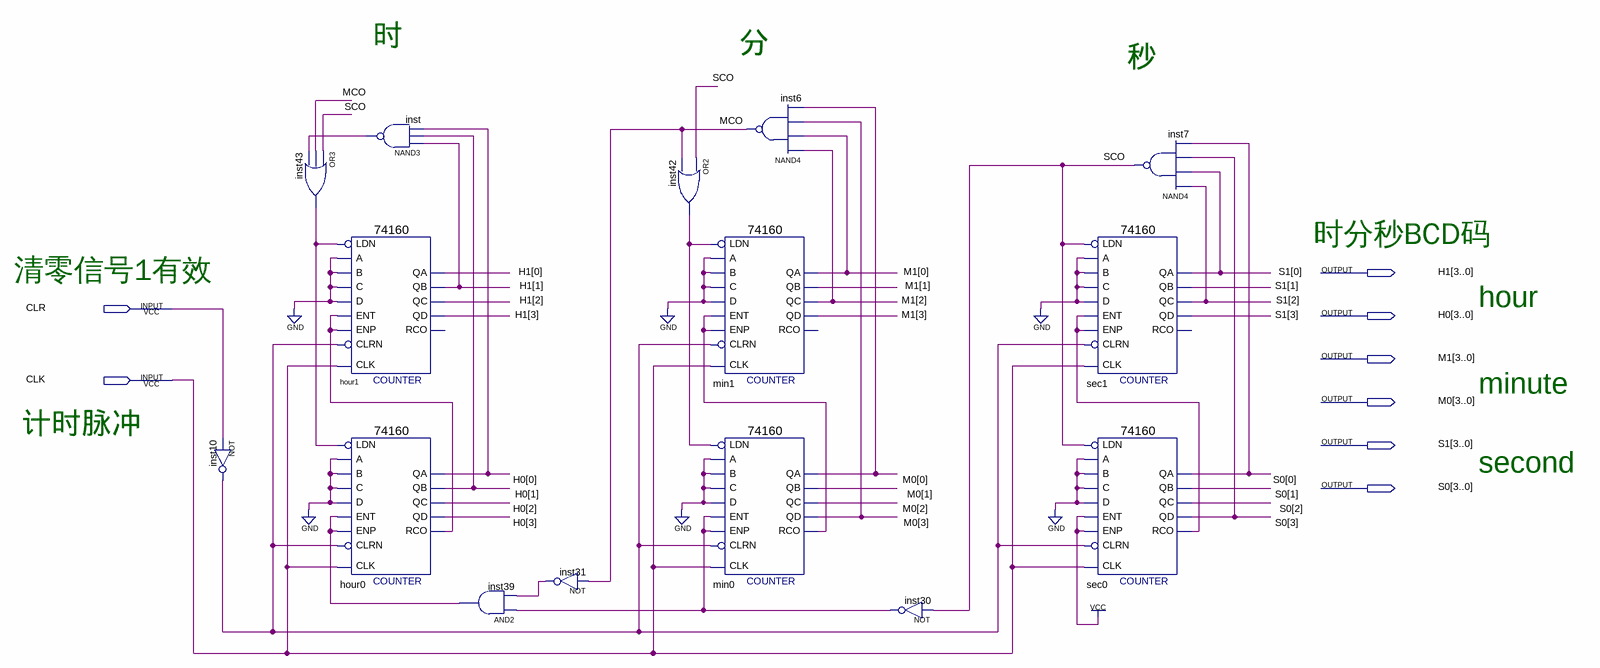
[diagram p0: schematic sheet]
// Quartus schematic clock.bdf as structural Verilog: 15 symbols, 8 pins
module clock (
  input  CLR,
  input  CLK,
  output [3:0] H1,
  output [3:0] H0,
  output [3:0] M1,
  output [3:0] M0,
  output [3:0] S1,
  output [3:0] S0
);

  wire hour0_rco, inst10_out, inst30_out, inst31_out, inst39_out, inst42_out, inst43_out, inst_out, MCO,
       min0_rco, SCO, sec0_rco;

  not inst10 (inst10_out, CLR);
  or inst43 (inst43_out, SCO, MCO, inst_out);
  \74160  hour1 (
    .CLK(CLK), .ENT(hour0_rco), .A(1'b0), .B(1'b0), .C(1'b0), .D(1'b0), .LDN(inst43_out), .ENP(hour0_rco),
    .CLRN(inst10_out), .QD(H1[3]), .QA(H1[0]), .QB(H1[1]), .QC(H1[2]));  // open: RCO
  \74160  hour0 (
    .CLK(CLK), .ENT(inst39_out), .A(1'b0), .B(1'b0), .C(1'b0), .D(1'b0), .LDN(inst43_out), .ENP(inst39_out),
    .CLRN(inst10_out), .QD(H0[3]), .QA(H0[0]), .QB(H0[1]), .QC(H0[2]), .RCO(hour0_rco));
  nand inst (inst_out, H1[1], H0[1], H0[0]);
  and inst39 (inst39_out, inst30_out, inst31_out);
  not inst31 (inst31_out, MCO);
  or inst42 (inst42_out, SCO, MCO);
  \74160  min1 (
    .CLK(CLK), .ENT(min0_rco), .A(1'b0), .B(1'b0), .C(1'b0), .D(1'b0), .LDN(inst42_out), .ENP(min0_rco),
    .CLRN(inst10_out), .QD(M1[3]), .QA(M1[0]), .QB(M1[1]), .QC(M1[2]));  // open: RCO
  \74160  min0 (
    .CLK(CLK), .ENT(inst30_out), .A(1'b0), .B(1'b0), .C(1'b0), .D(1'b0), .LDN(inst42_out), .ENP(inst30_out),
    .CLRN(inst10_out), .QD(M0[3]), .QA(M0[0]), .QB(M0[1]), .QC(M0[2]), .RCO(min0_rco));
  nand inst6 (MCO, M1[2], M1[0], M0[3], M0[0]);
  not inst30 (inst30_out, SCO);
  \74160  sec1 (
    .CLK(CLK), .ENT(sec0_rco), .A(1'b0), .B(1'b0), .C(1'b0), .D(1'b0), .LDN(SCO), .ENP(sec0_rco),
    .CLRN(inst10_out), .QD(S1[3]), .QA(S1[0]), .QB(S1[1]), .QC(S1[2]));  // open: RCO
  \74160  sec0 (
    .CLK(CLK), .ENT(1'b1), .A(1'b0), .B(1'b0), .C(1'b0), .D(1'b0), .LDN(SCO), .ENP(1'b1), .CLRN(inst10_out),
    .QD(S0[3]), .QA(S0[0]), .QB(S0[1]), .QC(S0[2]), .RCO(sec0_rco));
  nand inst7 (SCO, S1[2], S1[0], S0[3], S0[0]);

  // Notes on the sheet:
  //   时
  //   分
  //   秒
  //   时分秒BCD码
  //   清零信号1有效
  //   hour
  //   minute
  //   计时脉冲
  //   second
endmodule
